# Altium project SR-BMS-Master.PrjPcb
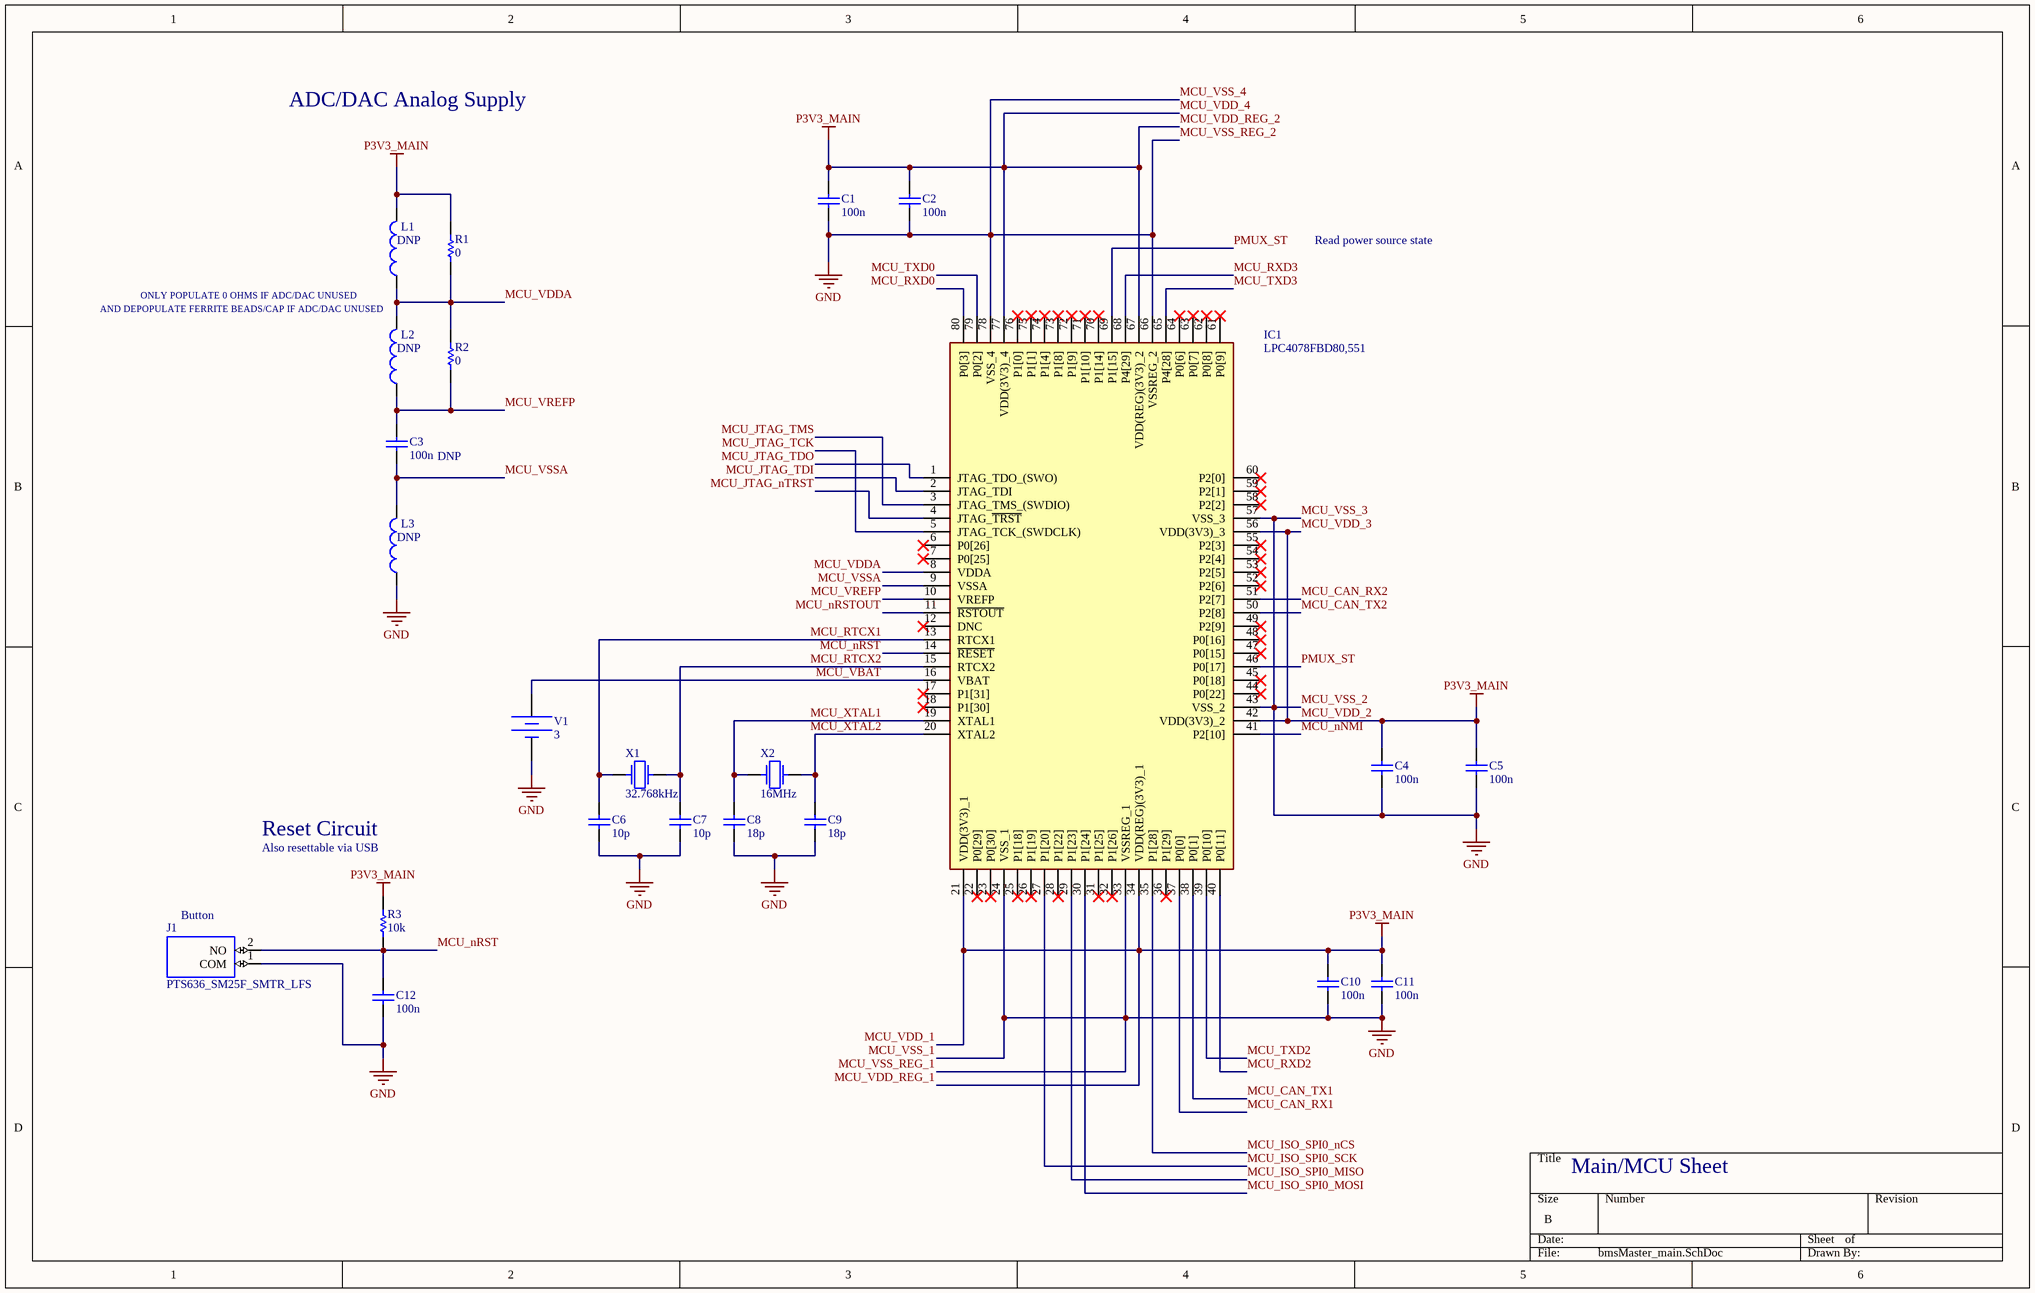
[diagram p0: bmsMaster_main.SchDoc]
7 sheets, 89 parts. Net scope: global (net labels, ports and power ports of the same name join across sheets).
Sheets:
  bmsMaster_main.SchDoc
  bmsMaster_conn.SchDoc
  bmsMaster_power.SchDoc
  bmsMaster_usb.SchDoc
  bmsMaster_isospi.SchDoc
  bmsMaster_can.SchDoc
  bmsMaster_led.SchDoc

## Sheet bmsMaster_main.SchDoc
size B; SheetNumber: 1; SheetTotal: 7

### Parts
C1  value 100n  (hidden comment: Capacitor)
C2  value 100n  (hidden comment: Capacitor)
C3  value 100n  (hidden comment: Capacitor)
C4  value 100n  (hidden comment: Capacitor)
C5  value 100n  (hidden comment: Capacitor)
C6  value 10p  (hidden comment: Capacitor)
C7  value 10p  (hidden comment: Capacitor)
C8  value 18p  (hidden comment: Capacitor)
C9  value 18p  (hidden comment: Capacitor)
C10  value 100n  (hidden comment: Capacitor)
C11  value 100n  (hidden comment: Capacitor)
C12  value 100n  (hidden comment: Capacitor)
IC1  LPC4078FBD80,551  [QFP50P1400X1400X160-80N]
J1  PTS636_SM25F_SMTR_LFS  [PTS636SM25FSMTRLFS]
L1  Inductor  (value not drawn)
L2  Inductor  (value not drawn)
L3  Inductor  (value not drawn)
R1  value 0  (hidden comment: Resistor)
R2  value 0  (hidden comment: Resistor)
R3  value 10k  (hidden comment: Resistor)
V1  DC Magnitude: 3  (hidden comment: Constant Voltage Source)
X1  F0: 32.768kHz  (hidden comment: Crystal)
X2  F0: 16MHz  (hidden comment: Crystal)

### Nets
MCU_VDD_1: C1.2 C2.2 C4.2 C5.2 C10.2 C11.2 IC1.21(VDD(3V3)_1) IC1.34(VDD(REG)(3V3)_1) IC1.42(VDD(3V3)_2) IC1.56(VDD(3V3)_3) IC1.67(VDD(REG)(3V3)_2) IC1.77(VDD(3V3)_4) L1.2 R1.2 R3.2  [also labelled MCU_VDD_2, MCU_VDD_3, MCU_VDD_4, MCU_VDD_REG_1, MCU_VDD_REG_2, P3V3_MAIN]  [project net CAN_BMS_VCC_1]
MCU_VSS_1: C1.1 C2.1 C4.1 C5.1 C6.1 C7.1 C8.1 C9.1 C10.1 C11.1 C12.1 IC1.24(VSS_1) IC1.33(VSSREG_1) IC1.43(VSS_2) IC1.57(VSS_3) IC1.66(VSSREG_2) IC1.78(VSS_4) J1.1(COM) L3.1 V1.2  [also labelled GND, MCU_VSS_2, MCU_VSS_3, MCU_VSS_4, MCU_VSS_REG_1, MCU_VSS_REG_2]
MCU_CAN_RX1: IC1.37(P0[0])
MCU_CAN_RX2: IC1.51(P2[7])
MCU_CAN_TX1: IC1.38(P0[1])
MCU_CAN_TX2: IC1.50(P2[8])
MCU_ISO_SPI0_MISO: IC1.29(P1[23])
MCU_ISO_SPI0_MOSI: IC1.30(P1[24])
MCU_ISO_SPI0_nCS: IC1.35(P1[28])
MCU_ISO_SPI0_SCK: IC1.27(P1[20])
MCU_JTAG_nTRST: IC1.4(JTAG_~{TRST})
MCU_JTAG_TCK: IC1.5(JTAG_TCK_(SWDCLK))
MCU_JTAG_TDI: IC1.2(JTAG_TDI)
MCU_JTAG_TDO: IC1.1(JTAG_TDO_(SWO))
MCU_JTAG_TMS: IC1.3(JTAG_TMS_(SWDIO))
MCU_nNMI: IC1.41(P2[10])
MCU_nRST: C12.2 IC1.14(~{RESET}) J1.2(NO) R3.1
MCU_nRSTOUT: IC1.11(~{RSTOUT})
MCU_RTCX1: C6.2 IC1.13(RTCX1) X1.1
MCU_RTCX2: C7.2 IC1.15(RTCX2) X1.2
MCU_RXD0: IC1.80(P0[3])
MCU_RXD2: IC1.40(P0[11])
MCU_RXD3: IC1.68(P4[29])
MCU_TXD0: IC1.79(P0[2])
MCU_TXD2: IC1.39(P0[10])
MCU_TXD3: IC1.65(P4[28])
MCU_VBAT: IC1.16(VBAT) V1.1
MCU_VDDA: IC1.8(VDDA) L1.1 L2.2 R1.1 R2.2
MCU_VREFP: C3.2 IC1.10(VREFP) L2.1 R2.1
MCU_VSSA: C3.1 IC1.9(VSSA) L3.2
MCU_XTAL1: C8.2 IC1.19(XTAL1) X2.1
MCU_XTAL2: C9.2 IC1.20(XTAL2) X2.2
PMUX_ST: IC1.46(P0[17]) IC1.69(P1[15])

Not connected (* = marked no-connect by the designer): IC1 6(P0[26])* 7(P0[25])* 12(DNC)* 17(P1[31])* 18(P1[30])* 22(P0[29])* 23(P0[30])* 25(P1[18])* 26(P1[19])* 28(P1[22])* 31(P1[25])* 32(P1[26])* 36(P1[29])* 44(P0[22])* 45(P0[18])* 47(P0[15])* 48(P0[16])* 49(P2[9])* 52(P2[6])* 53(P2[5])* 54(P2[4])* 55(P2[3])* 58(P2[2])* 59(P2[1])* 60(P2[0])* 61(P0[9])* 62(P0[8])* 63(P0[7])* 64(P0[6])* 70(P1[14])* 71(P1[10])* 72(P1[9])* 73(P1[8])* 74(P1[4])* 75(P1[1])* 76(P1[0])*

### Notes on the sheet
- ADC/DAC Analog Supply
- ONLY POPULATE 0 OHMS IF ADC/DAC UNUSED
- (near L1) DNP
- Read power source state
- AND DEPOPULATE FERRITE BEADS/CAP IF ADC/DAC UNUSED
- (near L2) DNP
- (near C3) DNP
- (near L3) DNP
- Reset Circuit
- Also resettable via USB
- (near J1) Button
- Main/MCU Sheet

### Library data of the parts
C1-C12 = Capacitor: SimulationGenericComponent: True
IC1 = LPC4078FBD80,551: Integrated Circuit; Manufacturer_Name: NXP; Datasheet Link: http://www.nxp.com/docs/en/data-sheet/LPC408X_7X.pdf; Height: 1.6mm; Manufacturer_Part_Number: LPC4078FBD80,551; Mouser Part Number: 771-LPC4078FBD80551; Mouser Price/Stock: https://www.mouser.co.uk/ProductDetail/NXP-Semiconductors/LPC4078FBD80551?qs=vnbNJPHmPnPMtBCcoSguaA%3D%3D; Arrow Part Number: LPC4078FBD80,551; Arrow Price/Stock: https://www.arrow.com/en/products/lpc4078fbd80551/nxp-semiconductors
J1 = PTS636_SM25F_SMTR_LFS: Tactile Switch SPST-NO Top Actuated Surface Mount; MF: C&K; MP: PTS636 SM25F SMTR LFS; SnapEDA_Link: https://www.snapeda.com/parts/PTS636%20SM25F%20SMTR%20LFS/C%2526K/view-part/?ref=snap; Check_prices: https://www.snapeda.com/parts/PTS636%20SM25F%20SMTR%20LFS/C%2526K/view-part/?ref=eda; Value: *; Purchase-URL: https://pricing.snapeda.com/search/part/PTS636 SM25F SMTR LFS/?ref=eda; Availability: In Stock; Price: None; Package: None
L1-L3 = Inductor: SimulationGenericComponent: True
R1 R2 = Resistor: SimulationGenericComponent: True; TC1: 0; TC2: 0
R3 = Resistor: TC1: 0; SimulationGenericComponent: True; TC2: 0
V1 = Battery: SimulationGenericComponent: True
X1 X2 = Crystal: R: 500; Q: 50K; SimulationGenericComponent: True

## Sheet bmsMaster_conn.SchDoc
size A; SheetNumber: 2; SheetTotal: 6
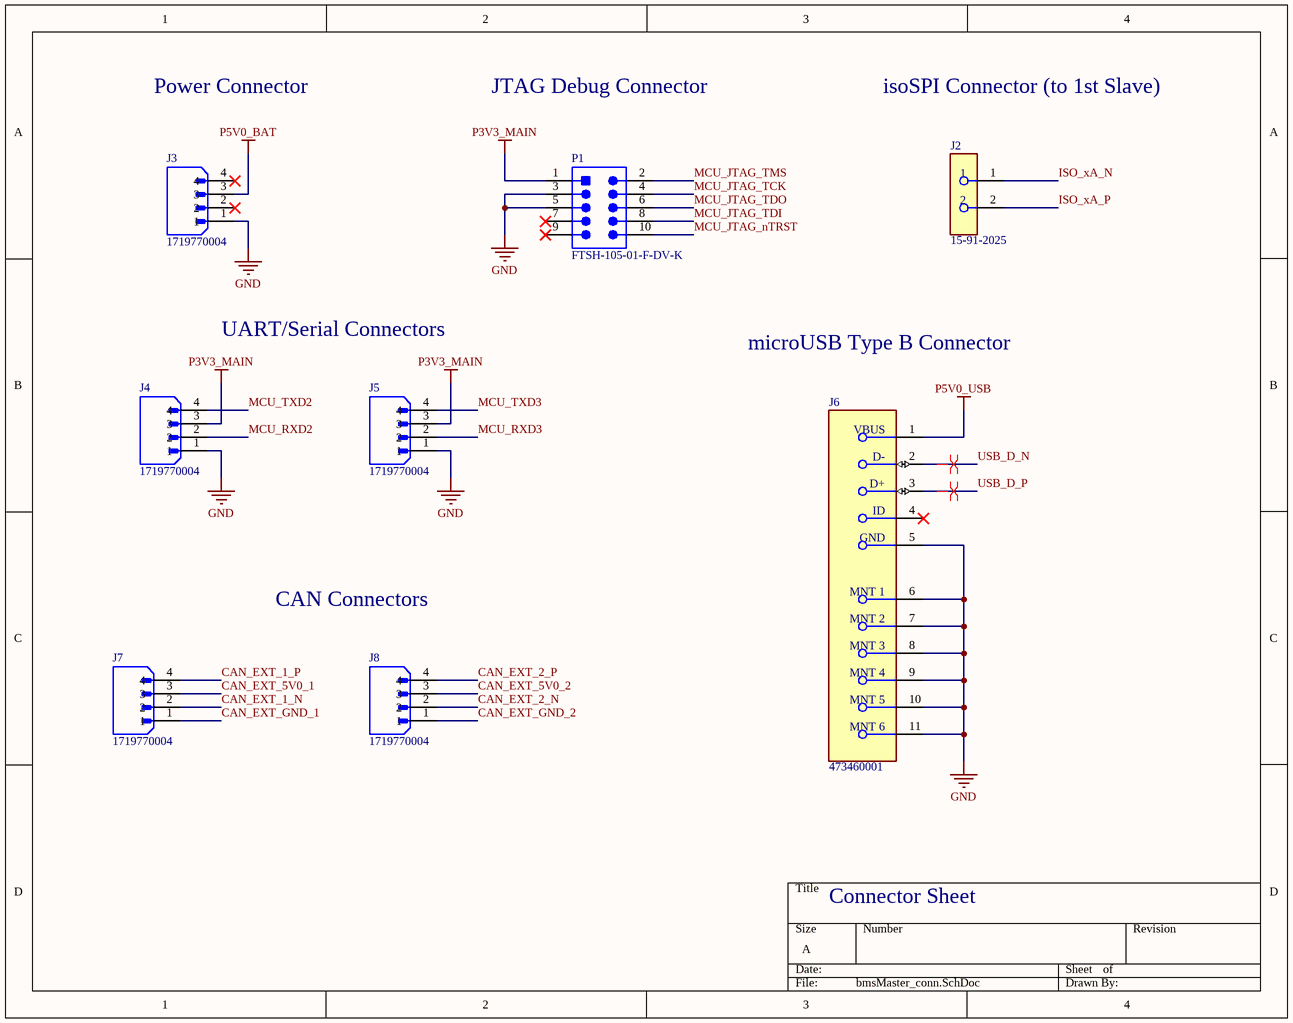
[diagram p1: bmsMaster_conn.SchDoc]

### Parts
J2  15-91-2025  [FP-15-91-2025-MFG]
J3  1719770004  [MOLEX_1719770004]
J4  1719770004  [MOLEX_1719770004]
J5  1719770004  [MOLEX_1719770004]
J6  473460001  [FP-473460001-MFG]
J7  1719770004  [MOLEX_1719770004]
J8  1719770004  [MOLEX_1719770004]
P1  FTSH-105-01-F-DV-K  [SMTC-FTSH-105-01-L-DV-K_V]

### Nets
GND: J3.1 J4.1 J5.1 J6.5(GND) J6.6(MNT_1) J6.7(MNT_2) J6.8(MNT_3) J6.9(MNT_4) J6.10(MNT_5) J6.11(MNT_6) P1.3 P1.5  [project net MCU_VSS_1]
P3V3_MAIN: J4.3 J5.3 P1.1  [project net CAN_BMS_VCC_1]
P5V0_BAT: J3.3
P5V0_USB: J6.1(VBUS)
CAN_EXT_1_N: J7.2
CAN_EXT_1_P: J7.4
CAN_EXT_2_N: J8.2
CAN_EXT_2_P: J8.4
CAN_EXT_5V0_1: J7.3
CAN_EXT_5V0_2: J8.3
CAN_EXT_GND_1: J7.1
CAN_EXT_GND_2: J8.1
ISO_xA_N: J2.1
ISO_xA_P: J2.2
MCU_JTAG_nTRST: P1.10
MCU_JTAG_TCK: P1.4
MCU_JTAG_TDI: P1.8
MCU_JTAG_TDO: P1.6
MCU_JTAG_TMS: P1.2
MCU_RXD2: J4.2
MCU_RXD3: J5.2
MCU_TXD2: J4.4
MCU_TXD3: J5.4
USB_D_N: J6.2(D-)
USB_D_P: J6.3(D+)

Not connected (* = marked no-connect by the designer): J3 2* 4*; J6 4(ID)*; P1 7* 9*

### Layout directives
differential pair: USB_D_N, USB_D_P

### Notes on the sheet
- Power Connector
- JTAG Debug Connector
- isoSPI Connector (to 1st Slave)
- UART/Serial Connectors
- microUSB Type B Connector
- CAN Connectors
- Connector Sheet

### Library data of the parts
J2 = CMP-04776-000618-1: CONN HEADER SMD R/A 2POS 2.54MM; Number of Contacts: 2; Voltage Rating: 250V; Max Current Rating: 1.75A; Contact Resistance: 30mR; Current Rating: 3A; Insulation Resistance: 1GR; Gender: Male; Glow Wire Compliant: Non-compliant; Contact Mating Length: 0.24inch; Max Operating Temperature: 105°C; Length: 8.64mm; Color: Black; REACH SVHC: No SVHC; Depth: 13.59mm; ELV: Compliant; Material: Brass; Contact Type: Male Pin; Number of Rows: 1; Number of Positions: 2; Housing Color: Black; Pitch: 2.54mm; Housing Material: Polyester; Flammability Rating: UL94 V-0; Packaging: Rail/Tube; RoHS Compliant: Yes; Radiation Hardening: No; Min Operating Temperature: -40°C; Termination: Solder; Mount: Surface Mount; Contact Plating: Gold; Package Quantity: 1830; Height: 5.56mm; Contact Material: Bronze; Orientation: Right Angle; Number of Circuits: 2; Lead Free: Contains Lead; Voltage Rating (DC): 250V; Series: C-Grid® SL™ 70634; Contact Gender: Male
J3-J5 J7 J8 = 1719770004: 2.54mm Pitch SL Header, Single Row, Right-Angle, LCP, Shrouded, Surface Mount, with Pegs, Matte Tin (Sn) Plating, 4 Circuits, Tube; MF: {'manufacturer': u'Molex'}; Price: None; Value: *; MP: 1719770004; Package: None; Availability: Unavailable
J6 = CMP-2000-05246-2: CONN RCPT USB2.0 MICRO B SMD R/A; Manufacturer: Molex; Conn Orientation: Right Angle; Is Female: yes; Shielding: true; Pitch: 0.65mm; Number Of Contacts: 5; Description: USB - micro B USB 2.0 Receptacle Connector 5 Position Surface Mount, Right Angle; Voltage Rating: 30V; Current Rating: 1.8A; Device Class L2: USB Connectors; Digikey Description: CONN RCPT USB2.0 MICRO B SMD R/A; Height: 2.945mm; RoHS: TRUE; ComponentLink2Description: Datasheet; Octopart: https://octopart.com/47346-0001-molex-7164928; Automotive: No; Package: 0; Category: Conn; Device Class L1: Connectors; Usb Standard: USB 2.0; Temperature: -30°C to +85°C; Temperature Range Low: -30°C; Footprint Url: https://www.molex.com/pdm_docs/sd/473460001_sd.pdf; ComponentLink2URL: https://www.molex.com/webdocs/datasheets/pdf/en-us/0473460001_IO_CONNECTORS.pdf; Lead Free: Yes; Manufacturer Part Number: 473460001; Contact Material: Gold,Nickel; Temperature Range High: +85°C; Device Class L3: unset
P1 = CMP-2000-05352-1: Male Header, Pitch 1.27 mm, 2 x 5 Position, Height 6.12 mm, RoHS, Tube; Manufacturer: Samtec; Number of Positions: 10; Connector Type: Header,Shrouded; Number of Positions Loaded: All; Row Spacing: 0.050"(1.27mm); Fastening Type: -; Package Reference: FTSH-105-01-L-DV-K; Termination: Solder; Package URL: http://suddendocs.samtec.com/prints/ftsh-1xx-xx-xxx-dv-xxx-footprint.pdf; Number of Rows: 2; Contact Finish Thickness: 3µin(0.08µm); Contact Type: MalePin; Manufacturer URL: http://www.samtec.com/; Contact Mating Length: 0.120"(3.05mm); Pitch: 0.050"(1.27mm); Series: FTSH; Features: -; Contact Finish: Gold; Color: Black; Family: RectangularConnectors-Headers,MalePins; Datasheet URL: http://suddendocs.samtec.com/prints/ftsh-1xx-xx-xxx-dv-xxx-mkt.pdf; Package Description: Male Header, Pitch 1.27 mm, 2 x 5 Position, Height 5.97 mm, Tail Length 4.32 mm; Mounting Type: SurfaceMount; Datasheet Version: Rev. ET, 10/1995; Category: Connectors,Interconnects; Packaging: Tube

## Sheet bmsMaster_power.SchDoc
size A; SheetNumber: 3; SheetTotal: 6
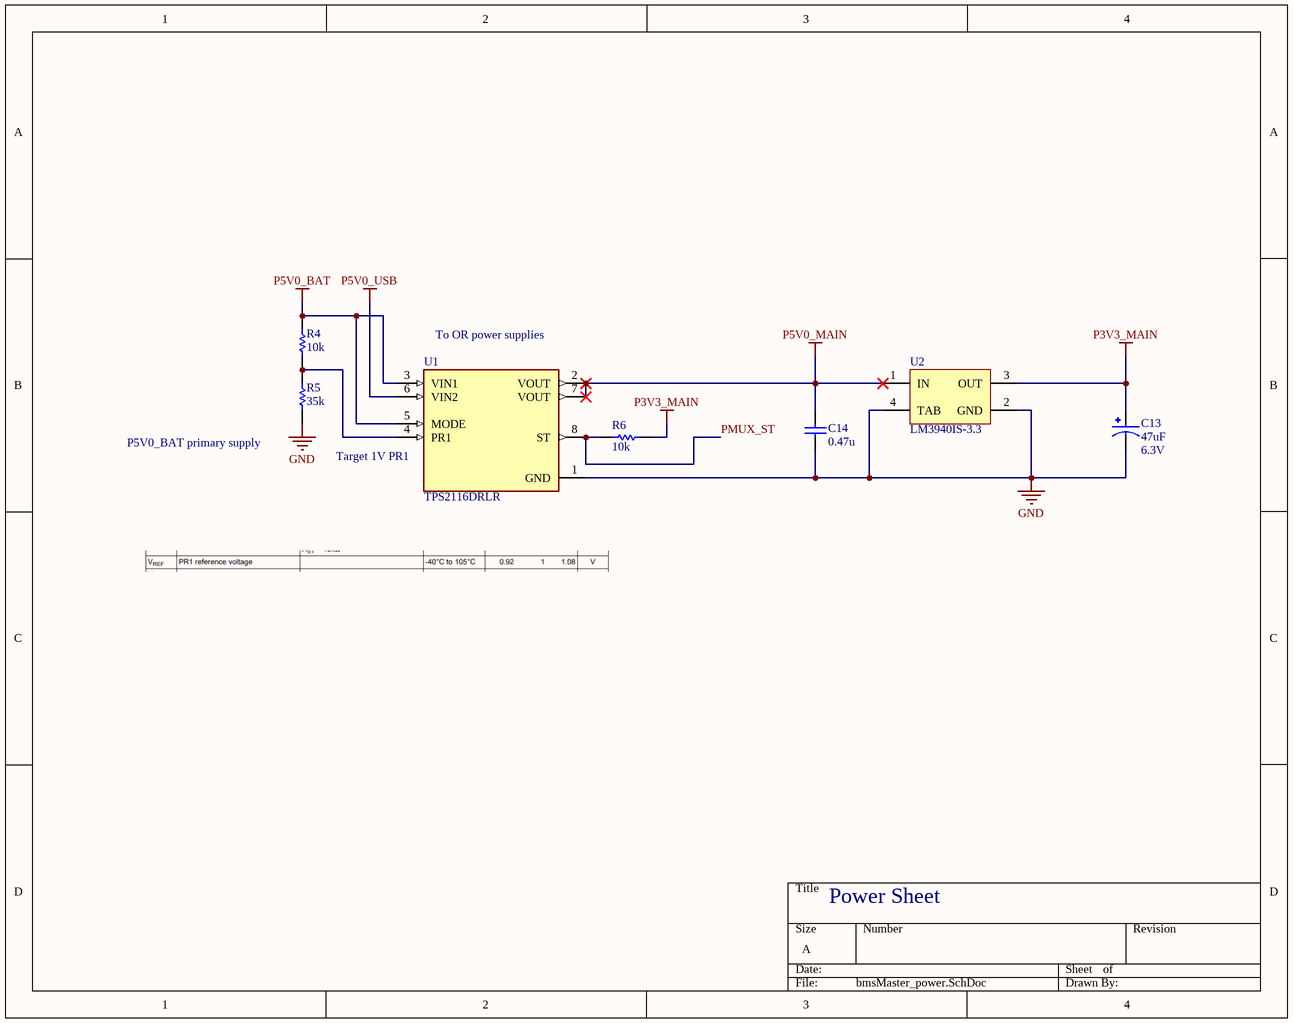
[diagram p2: bmsMaster_power.SchDoc]

### Parts
C13  value 47uF  Rating: 6.3V  [CAP_EEEHA0J470WR]  (hidden comment: EEEHA0J470WR)
C14  value 0.47u  (hidden comment: Capacitor)
R4  value 10k  (hidden comment: Resistor)
R5  value 35k  (hidden comment: Resistor)
R6  value 10k  (hidden comment: Resistor)
U1  TPS2116DRLR  [SOTFL50P160X60-8N]
U2  LM3940IS-3.3  [KTT0003B_N]

### Nets
GND: C13.2 C14.1 R5.1 U1.1(GND) U2.2(GND) U2.4(TAB)  [project net MCU_VSS_1]
P3V3_MAIN: C13.1 R6.1 U2.3(OUT)  [project net CAN_BMS_VCC_1]
P5V0_BAT: R4.2 U1.3(VIN1) U1.5(MODE)
P5V0_MAIN: C14.2 U1.2(VOUT) U1.7(VOUT) U2.1(IN)
P5V0_USB: U1.6(VIN2)
PMUX_ST: R6.2 U1.8(ST)
NetR4_1: R4.1 R5.2 U1.4(PR1)

### Notes on the sheet
- (near U1) To OR power supplies
- (near R5) P5V0_BAT primary supply
- (near U1) Target 1V PR1
- Power Sheet

### Library data of the parts
C13 = EEEHA0J470WR: MF: {'manufacturer': u'Panasonic'}; Package: None; Price: None; MP: EEEHA0J470WR; Availability: Unavailable
C14 = Capacitor: SimulationGenericComponent: True
R4-R6 = Resistor: TC1: 0; SimulationGenericComponent: True; TC2: 0
U1 = TPS2116DRLR: 1.6 V to 5.5 V, 2.5-A Low IQ Power Mux with Manual and Priority Switchover; MF: {'manufacturer': u'Texas Instruments'}; Value: *; Price: None; Package: None; Availability: Unavailable; MP: TPS2116DRLR
U2 = CMP-0062-00201-4: 1A Low Dropout Regulator for 5V to 3.3V Conversion, 3-pin TO-263; Manufacturer: Texas Instruments; CompType: LDO IC; PowerWise: N; PackageTopMarking: NSUZXYTTE#*LM3940IS*-3.3 P+; PinCount: 3; Code_JEDEC: MO-169-AA; PackageReference: KTT0003B; ComponentLink1URL: http://www.ti.com/general/docs/lit/getliterature.tsp?genericPartNumber=LM3940&fileType=pdf; RoHS: N; PackageDescription: TO-263, Molded, .400 x .390 x .180in, 3 Lead, .1in Pitch, Surface Mount; ComponentLink1Description: Datasheet URL

## Sheet bmsMaster_usb.SchDoc
size A; SheetNumber: 4; SheetTotal: 6
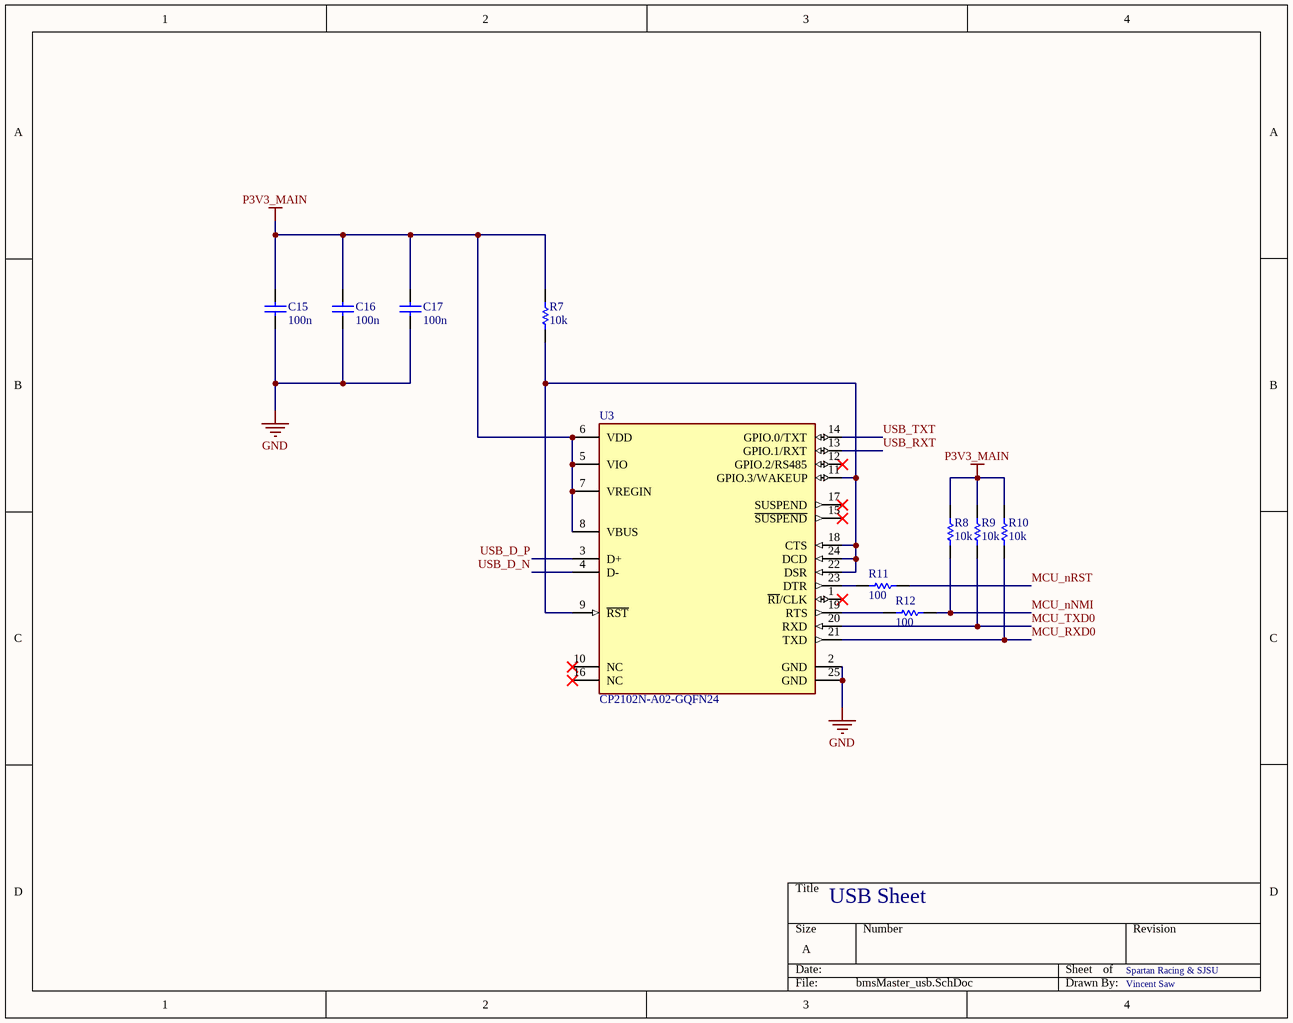
[diagram p3: bmsMaster_usb.SchDoc]

### Parts
C15  value 100n  (hidden comment: Capacitor)
C16  value 100n  (hidden comment: Capacitor)
C17  value 100n  (hidden comment: Capacitor)
R7  value 10k  (hidden comment: Resistor)
R8  value 10k  (hidden comment: Resistor)
R9  value 10k  (hidden comment: Resistor)
R10  value 10k  (hidden comment: Resistor)
R11  value 100  (hidden comment: Resistor)
R12  value 100  (hidden comment: Resistor)
U3  CP2102N-A02-GQFN24  [FP-CP2102N-A02-GQFN24-MFG]

### Nets
GND: C15.1 C16.1 C17.1 U3.2(GND) U3.25(GND)  [project net MCU_VSS_1]
P3V3_MAIN: C15.2 C16.2 C17.2 R7.2 R8.2 R9.2 R10.2 U3.5(VIO) U3.6(VDD) U3.7(VREGIN) U3.8(VBUS)  [project net CAN_BMS_VCC_1]
MCU_nNMI: R8.1 R12.1
MCU_nRST: R11.1
MCU_RXD0: R10.1 U3.21(TXD)
MCU_TXD0: R9.1 U3.20(RXD)
USB_D_N: U3.4(D-)
USB_D_P: U3.3(D+)
USB_RXT: U3.13(GPIO.1/RXT)
USB_TXT: U3.14(GPIO.0/TXT)
NetR7_1: R7.1 U3.9(~{RST}) U3.11(GPIO.3/WAKEUP) U3.18(CTS) U3.22(DSR) U3.24(DCD)
NetR11_2: R11.2 U3.23(DTR)
NetR12_2: R12.2 U3.19(RTS)

Not connected (* = marked no-connect by the designer): U3 1(~{RI}/CLK)* 10(NC)* 12(GPIO.2/RS485)* 15(~{SUSPEND})* 16(NC)* 17(SUSPEND)*

### Notes on the sheet
- USB Sheet
- Spartan Racing & SJSU
- Vincent Saw

### Library data of the parts
C15-C17 = Capacitor: SimulationGenericComponent: True
R7-R12 = Resistor: TC1: 0; SimulationGenericComponent: True; TC2: 0
U3 = CMP-08107-000010-1: IC USB TO UART BRIDGE QFN24

## Sheet bmsMaster_isospi.SchDoc
size A; SheetNumber: 5; SheetTotal: 7
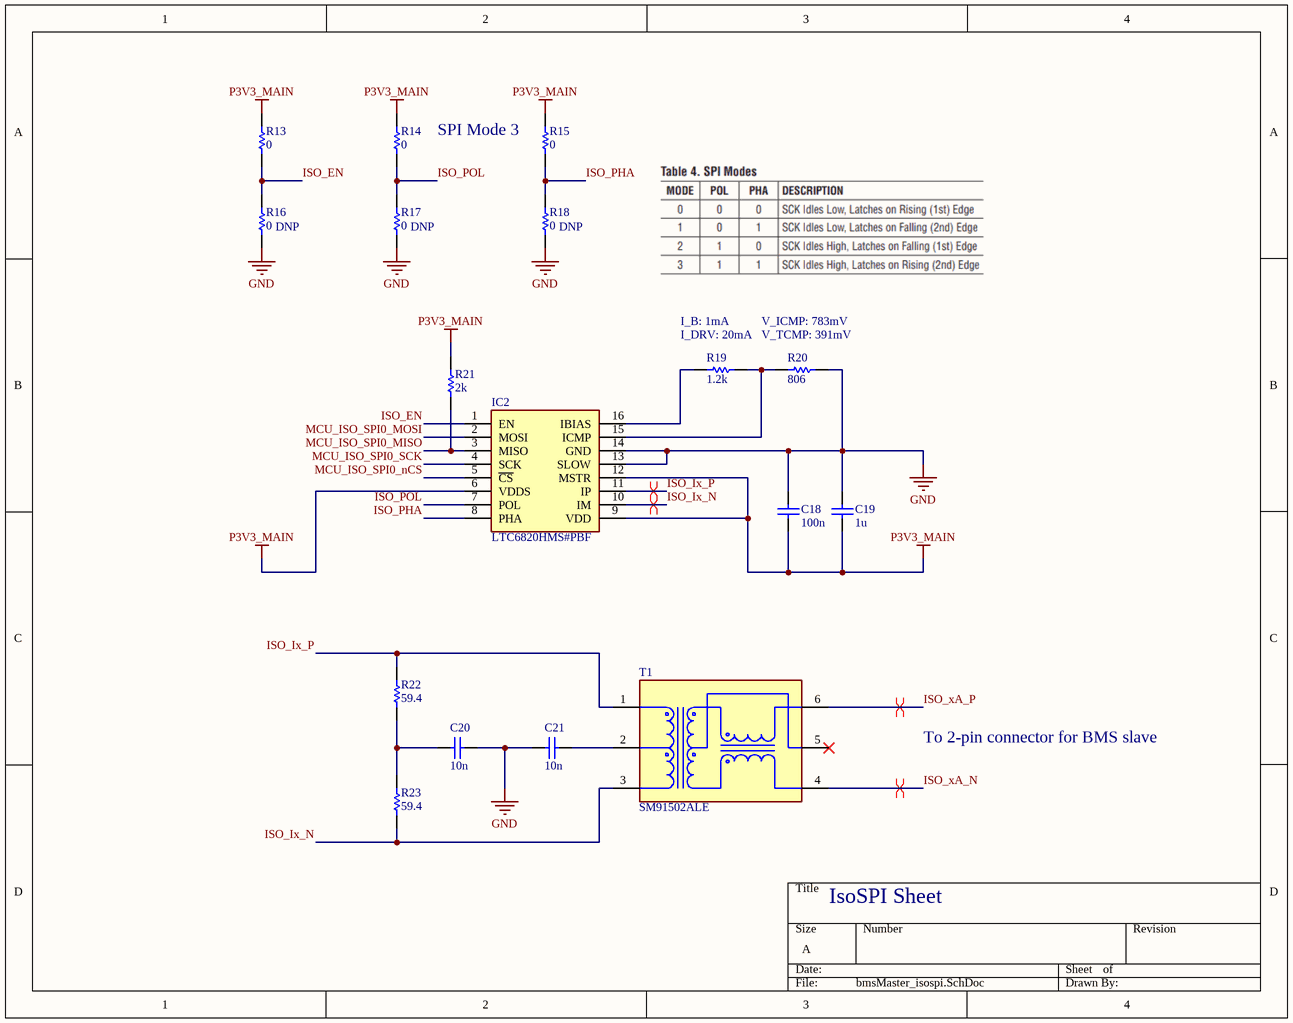
[diagram p4: bmsMaster_isospi.SchDoc]

### Parts
C18  value 100n  (hidden comment: Capacitor)
C19  value 1u  (hidden comment: Capacitor)
C20  value 10n  (hidden comment: Capacitor)
C21  value 10n  (hidden comment: Capacitor)
IC2  LTC6820HMS#PBF  [SOP50P490X110-16N]
R13  value 0  (hidden comment: Resistor)
R14  value 0  (hidden comment: Resistor)
R15  value 0  (hidden comment: Resistor)
R16  value 0  (hidden comment: Resistor)
R17  value 0  (hidden comment: Resistor)
R18  value 0  (hidden comment: Resistor)
R19  value 1.2k  (hidden comment: Resistor)
R20  value 806  (hidden comment: Resistor)
R21  value 2k  (hidden comment: Resistor)
R22  value 59.4  (hidden comment: Resistor)
R23  value 59.4  (hidden comment: Resistor)
T1  SM91502ALE  [FP-SM91502ALE-MFG]

### Nets
GND: C18.2 C19.2 C20.1 C21.1 IC2.13(SLOW) IC2.14(GND) R16.1 R17.1 R18.1 R20.2  [project net MCU_VSS_1]
P3V3_MAIN: C18.1 C19.1 IC2.6(VDDS) IC2.9(VDD) IC2.12(MSTR) R13.2 R14.2 R15.2 R21.2  [project net CAN_BMS_VCC_1]
ISO_EN: IC2.1(EN) R13.1 R16.2
ISO_Ix_N: IC2.10(IM) R23.1 T1.3
ISO_Ix_P: IC2.11(IP) R22.2 T1.1
ISO_PHA: IC2.8(PHA) R15.1 R18.2
ISO_POL: IC2.7(POL) R14.1 R17.2
ISO_xA_N: T1.4
ISO_xA_P: T1.6
MCU_ISO_SPI0_MISO: IC2.3(MISO) R21.1
MCU_ISO_SPI0_MOSI: IC2.2(MOSI)
MCU_ISO_SPI0_nCS: IC2.5(~{CS})
MCU_ISO_SPI0_SCK: IC2.4(SCK)
NetC20_2: C20.2 R22.1 R23.2
NetC21_2: C21.2 T1.2
NetIC2_15: IC2.15(ICMP) R19.2 R20.1
NetIC2_16: IC2.16(IBIAS) R19.1

Not connected (* = marked no-connect by the designer): T1 5*

### Layout directives
differential pair: ISO_Ix_N, ISO_Ix_P, ISO_xA_N, ISO_xA_P

### Notes on the sheet
- (near R15) SPI Mode 3
- (near R16) DNP
- (near R17) DNP
- (near R18) DNP
- (near R19) I_B: 1mA
- (near R19) I_DRV: 20mA
- V_ICMP: 783mV
- V_TCMP: 391mV
- To 2-pin connector for BMS slave
- IsoSPI Sheet

### Library data of the parts
C18-C21 = Capacitor: SimulationGenericComponent: True
IC2 = LTC6820HMS#PBF: Integrated Circuit; Manufacturer_Name: Analog Devices; Datasheet Link: https://www.analog.com/media/en/technical-documentation/data-sheets/LTC6820.pdf; Height: 1.1mm; Manufacturer_Part_Number: LTC6820HMS#PBF; Mouser Part Number: 584-LTC6820HMS#PBF; Mouser Price/Stock: https://www.mouser.co.uk/ProductDetail/Analog-Devices/LTC6820HMSPBF?qs=hVkxg5c3xu%252BAhS55eUb%252BEQ%3D%3D; Arrow Part Number: LTC6820HMS#PBF; Arrow Price/Stock: https://www.arrow.com/en/products/ltc6820hmspbf/analog-devices?region=europe
R13-R18 = Resistor: SimulationGenericComponent: True; TC1: 0; TC2: 0
R19-R23 = Resistor: TC1: 0; SimulationGenericComponent: True; TC2: 0
T1 = CMP-07264-000001-1: BMS XFORMER 1-CH 1000V AECQ +125; Manufacturer: Bourns; Standoff Height: 0.13mm; Turns Ratio: 1:1; Automotive Grade: Grade 1; Isolation Voltage: 4300VDC; Return Loss: -22dB; Insertion Loss: -0.25dB; Height: 5.72mm; Automotive: Yes; Package: 0; Device Class L3: unset; ComponentLink2Description: Datasheet; Category: Trans; ComponentLink2URL: https://www.bourns.com/docs/product-datasheets/SM91502AL.pdf; Device Class L1: Passive Components; Manufacturer Part Number: SM91502ALE; Temperature Range High: +125°C; Digikey Description: BMS XFORMER 1-CH 1000V AECQ +125; RoHS: TRUE; Lead Free: Yes; Octopart: https://octopart.com/sm91502ale-bourns-95732123; Device Class L2: Transformers; Temperature: -40°C to +125°C; Temperature Range Low: -40°C

## Sheet bmsMaster_can.SchDoc
size A; SheetNumber: 6; SheetTotal: 6
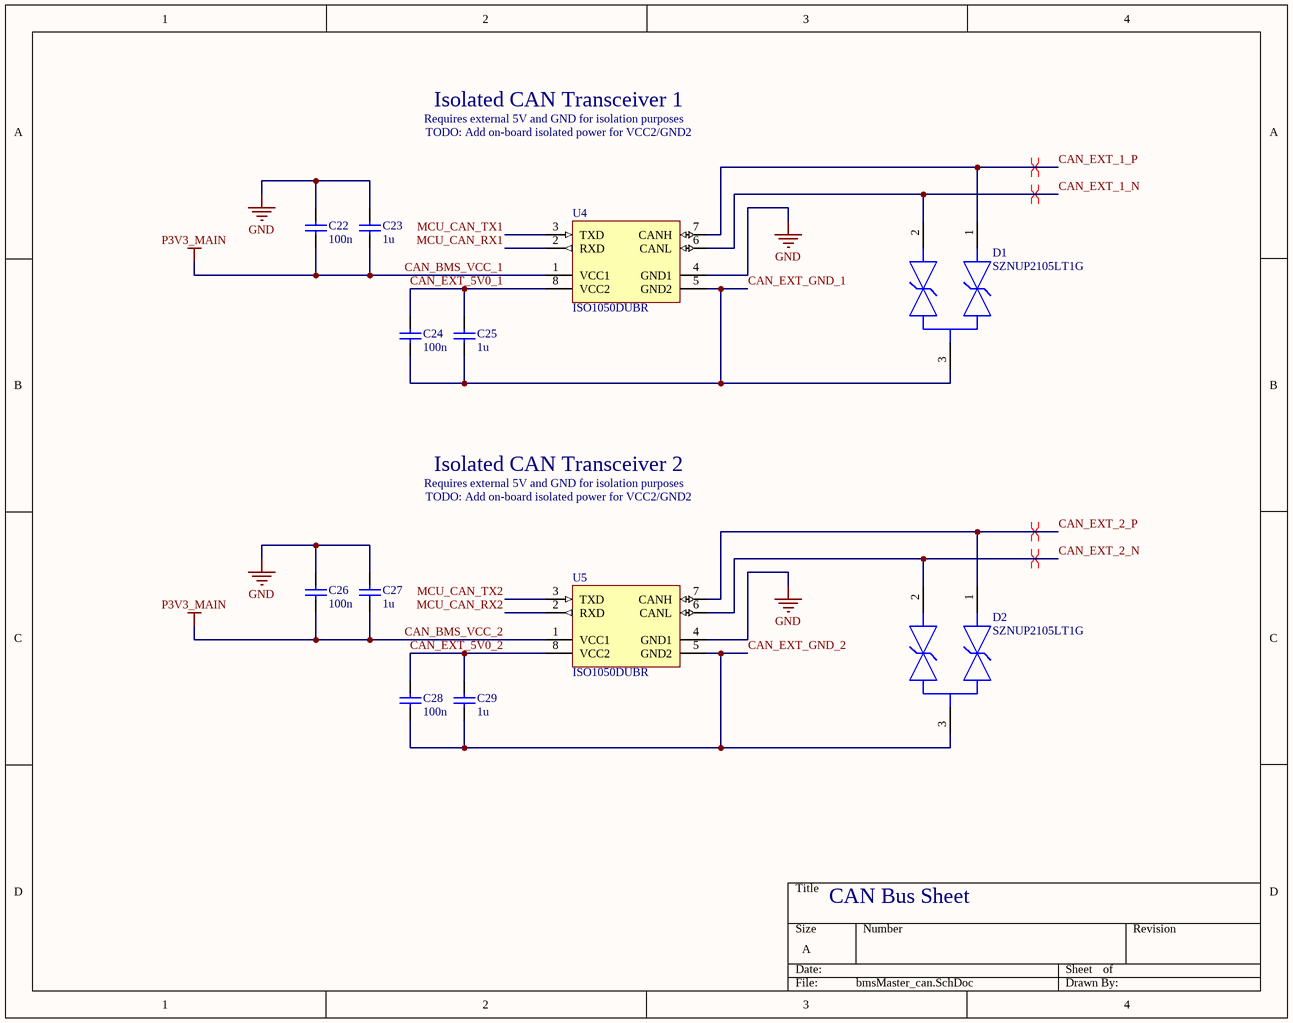
[diagram p5: bmsMaster_can.SchDoc]

### Parts
C22  value 100n  (hidden comment: Capacitor)
C23  value 1u  (hidden comment: Capacitor)
C24  value 100n  (hidden comment: Capacitor)
C25  value 1u  (hidden comment: Capacitor)
C26  value 100n  (hidden comment: Capacitor)
C27  value 1u  (hidden comment: Capacitor)
C28  value 100n  (hidden comment: Capacitor)
C29  value 1u  (hidden comment: Capacitor)
D1  SZNUP2105LT1G  [FP-318-08-MFG]
D2  SZNUP2105LT1G  [FP-318-08-MFG]
U4  ISO1050DUBR  [DUB0008A_L]
U5  ISO1050DUBR  [DUB0008A_L]

### Nets
CAN_BMS_VCC_1: C22.1 C23.1 C26.1 C27.1 U4.1(VCC1) U5.1(VCC1)  [also labelled CAN_BMS_VCC_2, P3V3_MAIN]
GND: C22.2 C23.2 C26.2 C27.2 U4.4(GND1) U5.4(GND1)  [project net MCU_VSS_1]
CAN_EXT_1_N: D1.2 U4.6(CANL)
CAN_EXT_1_P: D1.1 U4.7(CANH)
CAN_EXT_2_N: D2.2 U5.6(CANL)
CAN_EXT_2_P: D2.1 U5.7(CANH)
CAN_EXT_5V0_1: C24.2 C25.2 U4.8(VCC2)
CAN_EXT_5V0_2: C28.2 C29.2 U5.8(VCC2)
CAN_EXT_GND_1: C24.1 C25.1 D1.3 U4.5(GND2)
CAN_EXT_GND_2: C28.1 C29.1 D2.3 U5.5(GND2)
MCU_CAN_RX1: U4.2(RXD)
MCU_CAN_RX2: U5.2(RXD)
MCU_CAN_TX1: U4.3(TXD)
MCU_CAN_TX2: U5.3(TXD)

### Layout directives
differential pair: CAN_EXT_1_N, CAN_EXT_1_P, CAN_EXT_2_N, CAN_EXT_2_P

### Notes on the sheet
- Requires external 5V and GND for isolation purposes
- Isolated CAN Transceiver 1
- TODO: Add on-board isolated power for VCC2/GND2
- Isolated CAN Transceiver 2
- CAN Bus Sheet

### Library data of the parts
C22-C29 = Capacitor: SimulationGenericComponent: True
D1 D2 = CMP-1063-00167-2: TVS DIODE 24V 44V SOT23-3; Manufacturer: ON Semiconductor; Capacitance: 30pF; Max Junction Temp: +150°C; Breakdown Voltage: 26.2V; Number Of Channels: 2; Automotive Grade: Grade 0; Standoff Height: 0.01mm; Peak Pulse Current: 8A; Value: 30pF; Direction: Bidirectional; Peak Pulse Power: 350W; Octopart: https://octopart.com/sznup2105lt1g-on+semiconductor-22134626; Reverse Standoff Voltage: 24V; Digikey Description: TVS DIODE 24V 44V SOT23-3; RoHS: TRUE; Manufacturer Part Number: SZNUP2105LT1G; Height: 1.11mm; Automotive: Yes; ComponentLink2URL: https://www.onsemi.com/pub/Collateral/NUP2105L-D.PDF; Device Class L3: unset; Package: 318-08; Lead Free: Yes; Device Class L2: TVS Diodes; Footprint Url: https://www.onsemi.com/pub/Collateral/318-08.PDF; Temperature Range Low: -55°C; Device Class L1: Circuit Protection; Temperature: -55°C to +150°C; Temperature Range High: +150°C; Category: Diode; Clamping Voltage: 44V; ComponentLink2Description: Datasheet
U4 U5 = CMP-0315-00093-2: Isolated CAN Transceiver, -55 to 105 degC, 8-pin SOP (DUB), Green (RoHS & no Sb/Br); Manufacturer: Texas Instruments; Rating: Catalog; Isolated: Yes; Drivers Per Package: 1; PackageReference: DUB0008A; PartNumber: ISO1050DUBR; ComponentLink2Description: Package Specification; ComponentLink1Description: Datasheet; Mounting Technology: Surface Mount; ComponentLink1URL: http://www.ti.com/general/docs/lit/getliterature.tsp?genericPartNumber=ISO1050&fileType=pdf; ComponentLink2URL: http://www.ti.com/litv/pdf/mpds247b; Eco-Plan: Green (RoHS & no Sb/Br); PackageDescription: 8-Pin Small Outline Package 2.54 mm Pitch; PackageVersion: revC, May-2006; SubFamily: CAN; DatasheetVersion: SLLS983E

## Sheet bmsMaster_led.SchDoc
size A; SheetNumber: 6; SheetTotal: 6
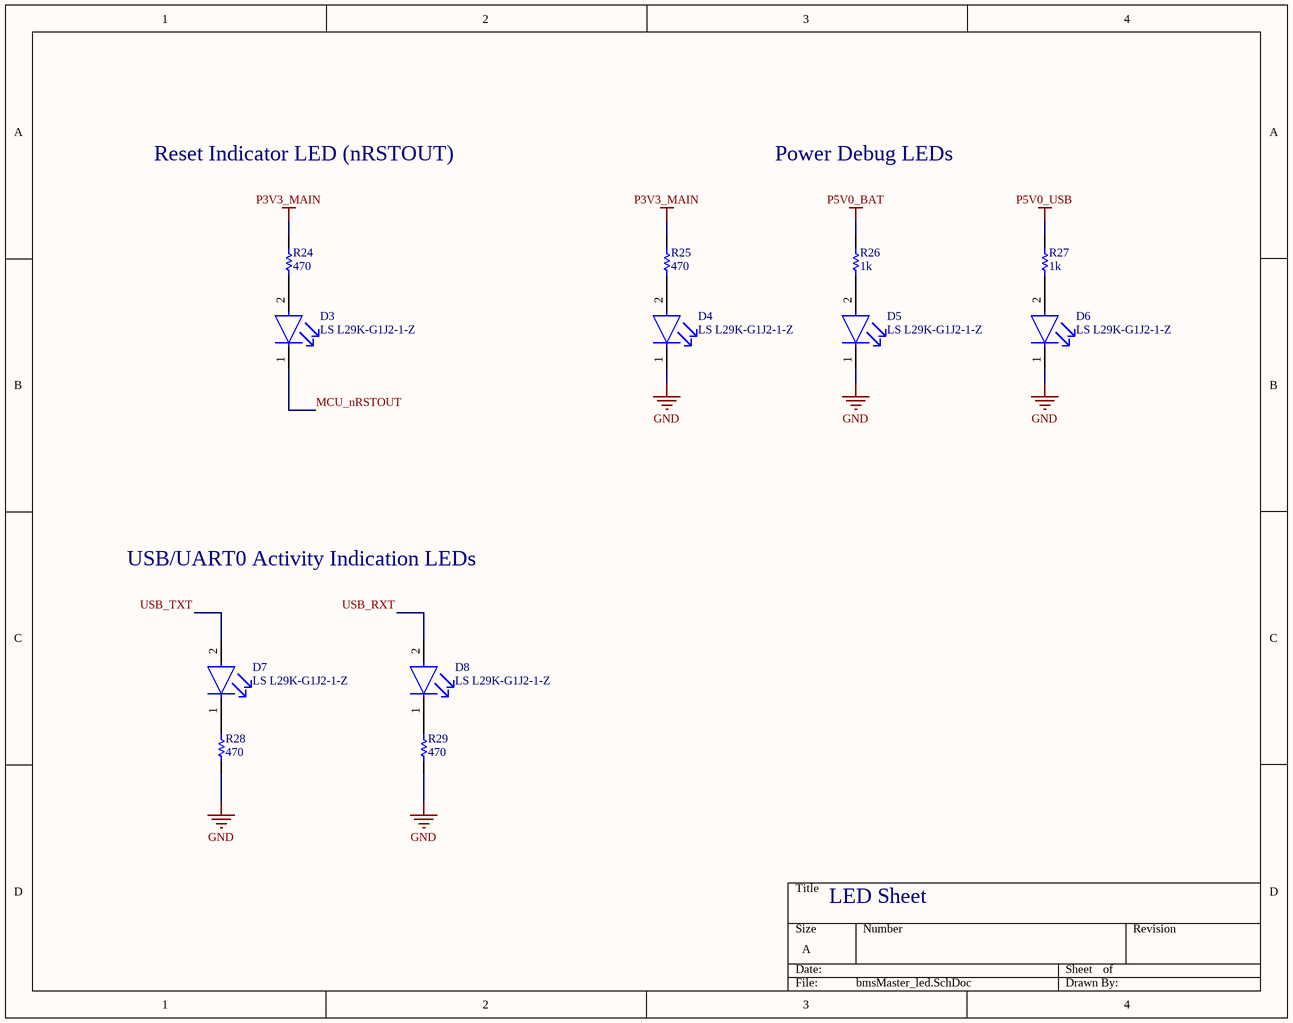
[diagram p6: bmsMaster_led.SchDoc]

### Parts
D3  LS L29K-G1J2-1-Z  [FP-LS_L29K-MFG]
D4  LS L29K-G1J2-1-Z  [FP-LS_L29K-MFG]
D5  LS L29K-G1J2-1-Z  [FP-LS_L29K-MFG]
D6  LS L29K-G1J2-1-Z  [FP-LS_L29K-MFG]
D7  LS L29K-G1J2-1-Z  [FP-LS_L29K-MFG]
D8  LS L29K-G1J2-1-Z  [FP-LS_L29K-MFG]
R24  value 470  (hidden comment: Resistor)
R25  value 470  (hidden comment: Resistor)
R26  value 1k  (hidden comment: Resistor)
R27  value 1k  (hidden comment: Resistor)
R28  value 470  (hidden comment: Resistor)
R29  value 470  (hidden comment: Resistor)

### Nets
GND: D4.1(C) D5.1(C) D6.1(C) R28.1 R29.1  [project net MCU_VSS_1]
P3V3_MAIN: R24.2 R25.2  [project net CAN_BMS_VCC_1]
P5V0_BAT: R26.2
P5V0_USB: R27.2
MCU_nRSTOUT: D3.1(C)
USB_RXT: D8.2(A)
USB_TXT: D7.2(A)
NetD3_2: D3.2(A) R24.1
NetD4_2: D4.2(A) R25.1
NetD5_2: D5.2(A) R26.1
NetD6_2: D6.2(A) R27.1
NetD7_1: D7.1(C) R28.2
NetD8_1: D8.1(C) R29.2

### Notes on the sheet
- Reset Indicator LED (nRSTOUT)
- Power Debug LEDs
- USB/UART0 Activity Indication LEDs
- LED Sheet

### Library data of the parts
D3-D8 = CMP-62016-000014-1: LED RED DIFFUSED 0603 SMD; Manufacturer: Osram Opto; Luminous Flux: 0.0081/0.0254lm; Forward Voltage: 1.8V; Luminous Intensity: 1.8-2.24/5.6-7.1mcd; Reverse Voltage: 12V; Peak Emmision Wavelength: 643nm; Max Junction Temp: +110°C; Viewing Angle: 160°; Wavelength: 630nm; Forward Current: 2mA; Led Orientation: Top View; Category: Diode; Temperature Range High: +100°C; Automotive: No; Temperature: -40°C to +100°C; Device Class L3: unset; Mouser Description: LED Uni-Color Red 643nm Automotive 2-Pin SMD T/R; Manufacturer Part Number: LS L29K-G1J2-1-Z; ComponentLink2Description: Datasheet; Lead Free: Yes; Device Class L2: LEDs; ComponentLink2URL: https://dammedia.osram.info/media/resource/hires/osram-dam-5662679/LS%20L29K_EN.pdf; Temperature Range Low: -40°C; RoHS: TRUE; Digikey Description: LED RED DIFFUSED 0603 SMD; Colour: Red; Device Class L1: Optoelectronics; Package: LS_L29K; Octopart: https://octopart.com/ls+l29k-g1j2-1-z-osram+opto-31093939; Height: 0.67mm
R24-R29 = Resistor: TC1: 0; SimulationGenericComponent: True; TC2: 0

## Nets that join several sheets
CAN_BMS_VCC_1: bmsMaster_main (15 pins), bmsMaster_conn (J4.3 J5.3 P1.1), bmsMaster_power (C13.1 R6.1 U2.3), bmsMaster_usb (11 pins), bmsMaster_isospi (9 pins), bmsMaster_can (6 pins), bmsMaster_led (R24.2 R25.2)
MCU_VSS_1: bmsMaster_main (20 pins), bmsMaster_conn (12 pins), bmsMaster_power (6 pins), bmsMaster_usb (5 pins), bmsMaster_isospi (10 pins), bmsMaster_can (6 pins), bmsMaster_led (5 pins)
P5V0_BAT: bmsMaster_conn (J3.3), bmsMaster_power (R4.2 U1.3 U1.5), bmsMaster_led (R26.2)
P5V0_USB: bmsMaster_conn (J6.1), bmsMaster_power (U1.6), bmsMaster_led (R27.2)
CAN_EXT_1_N: bmsMaster_conn (J7.2), bmsMaster_can (D1.2 U4.6)
CAN_EXT_1_P: bmsMaster_conn (J7.4), bmsMaster_can (D1.1 U4.7)
CAN_EXT_2_N: bmsMaster_conn (J8.2), bmsMaster_can (D2.2 U5.6)
CAN_EXT_2_P: bmsMaster_conn (J8.4), bmsMaster_can (D2.1 U5.7)
CAN_EXT_5V0_1: bmsMaster_conn (J7.3), bmsMaster_can (C24.2 C25.2 U4.8)
CAN_EXT_5V0_2: bmsMaster_conn (J8.3), bmsMaster_can (C28.2 C29.2 U5.8)
CAN_EXT_GND_1: bmsMaster_conn (J7.1), bmsMaster_can (C24.1 C25.1 D1.3 U4.5)
CAN_EXT_GND_2: bmsMaster_conn (J8.1), bmsMaster_can (C28.1 C29.1 D2.3 U5.5)
ISO_xA_N: bmsMaster_conn (J2.1), bmsMaster_isospi (T1.4)
ISO_xA_P: bmsMaster_conn (J2.2), bmsMaster_isospi (T1.6)
MCU_CAN_RX1: bmsMaster_main (IC1.37), bmsMaster_can (U4.2)
MCU_CAN_RX2: bmsMaster_main (IC1.51), bmsMaster_can (U5.2)
MCU_CAN_TX1: bmsMaster_main (IC1.38), bmsMaster_can (U4.3)
MCU_CAN_TX2: bmsMaster_main (IC1.50), bmsMaster_can (U5.3)
MCU_ISO_SPI0_MISO: bmsMaster_main (IC1.29), bmsMaster_isospi (IC2.3 R21.1)
MCU_ISO_SPI0_MOSI: bmsMaster_main (IC1.30), bmsMaster_isospi (IC2.2)
MCU_ISO_SPI0_nCS: bmsMaster_main (IC1.35), bmsMaster_isospi (IC2.5)
MCU_ISO_SPI0_SCK: bmsMaster_main (IC1.27), bmsMaster_isospi (IC2.4)
MCU_JTAG_nTRST: bmsMaster_main (IC1.4), bmsMaster_conn (P1.10)
MCU_JTAG_TCK: bmsMaster_main (IC1.5), bmsMaster_conn (P1.4)
MCU_JTAG_TDI: bmsMaster_main (IC1.2), bmsMaster_conn (P1.8)
MCU_JTAG_TDO: bmsMaster_main (IC1.1), bmsMaster_conn (P1.6)
MCU_JTAG_TMS: bmsMaster_main (IC1.3), bmsMaster_conn (P1.2)
MCU_nNMI: bmsMaster_main (IC1.41), bmsMaster_usb (R8.1 R12.1)
MCU_nRST: bmsMaster_main (C12.2 IC1.14 J1.2 R3.1), bmsMaster_usb (R11.1)
MCU_nRSTOUT: bmsMaster_main (IC1.11), bmsMaster_led (D3.1)
MCU_RXD0: bmsMaster_main (IC1.80), bmsMaster_usb (R10.1 U3.21)
MCU_RXD2: bmsMaster_main (IC1.40), bmsMaster_conn (J4.2)
MCU_RXD3: bmsMaster_main (IC1.68), bmsMaster_conn (J5.2)
MCU_TXD0: bmsMaster_main (IC1.79), bmsMaster_usb (R9.1 U3.20)
MCU_TXD2: bmsMaster_main (IC1.39), bmsMaster_conn (J4.4)
MCU_TXD3: bmsMaster_main (IC1.65), bmsMaster_conn (J5.4)
PMUX_ST: bmsMaster_main (IC1.46 IC1.69), bmsMaster_power (R6.2 U1.8)
USB_D_N: bmsMaster_conn (J6.2), bmsMaster_usb (U3.4)
USB_D_P: bmsMaster_conn (J6.3), bmsMaster_usb (U3.3)
USB_RXT: bmsMaster_usb (U3.13), bmsMaster_led (D8.2)
USB_TXT: bmsMaster_usb (U3.14), bmsMaster_led (D7.2)